# Altium schematic sheet Presencia_Agua.SchDoc
size Letter
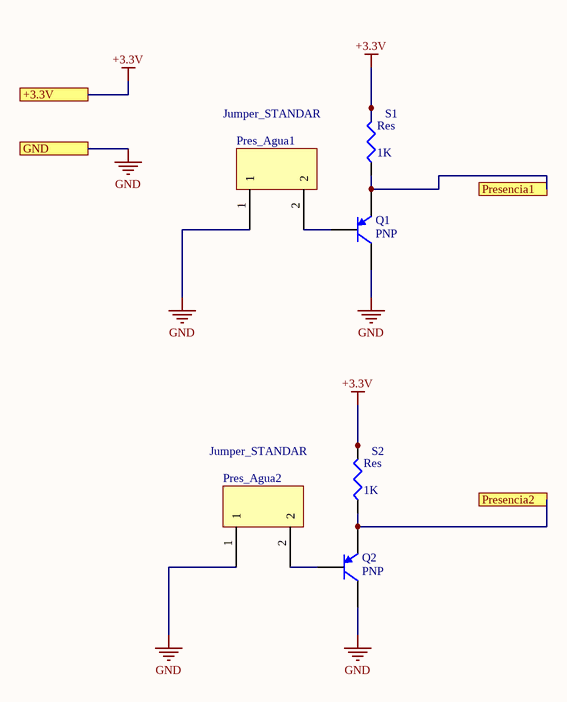
[diagram p0: Presencia_Agua.SchDoc]

## Parts
Pres_Agua1  Jumper_STANDAR  [HDR1X2H]
Pres_Agua2  Jumper_STANDAR  [HDR1X2H]
Q1  PNP  [SOT-23B_L]
Q2  PNP  [SOT-23B_L]
S1  Res  value 1K  [6-0805_L]
S2  Res  value 1K  [6-0805_L]

## Ports
+3.3V, GND, Presencia1, Presencia2

## Nets
+3.3V: S1.2 S2.2 ; port +3.3V
GND: Pres_Agua1.1 Pres_Agua2.1 Q1.1(C) Q2.1(C) ; port GND
Presencia1: Q1.3(E) S1.1 ; port Presencia1
Presencia2: Q2.3(E) S2.1 ; port Presencia2
NetPres_Agua1_2: Pres_Agua1.2 Q1.2(B)
NetPres_Agua2_2: Pres_Agua2.2 Q2.2(B)

## Library data of the parts
Q1 Q2 = PNP: PNP Bipolar Transistor; Published: 8-Jun-2000; LatestRevisionDate: 29-May-2009; LatestRevisionNote: IPC-7351 Footprint Added.; PackageVersion: Aug-1999; PackageReference: SOT-23B; Publisher: Altium Limited; PackageDescription: 3-Pin SOT-23 Package 0.95 mm Pitch, 2.4 mm Lead Span
S1 S2 = Res3: Resistor; Published: 8-Jun-2000; LatestRevisionDate: 29-May-2009; LatestRevisionNote: IPC-7351 Footprint Added.; PackageReference: J1-0603; Publisher: Altium Limited; PackageDescription: Chip Resistor